# EAGLE design lcd (EAGLE 9.3.2)
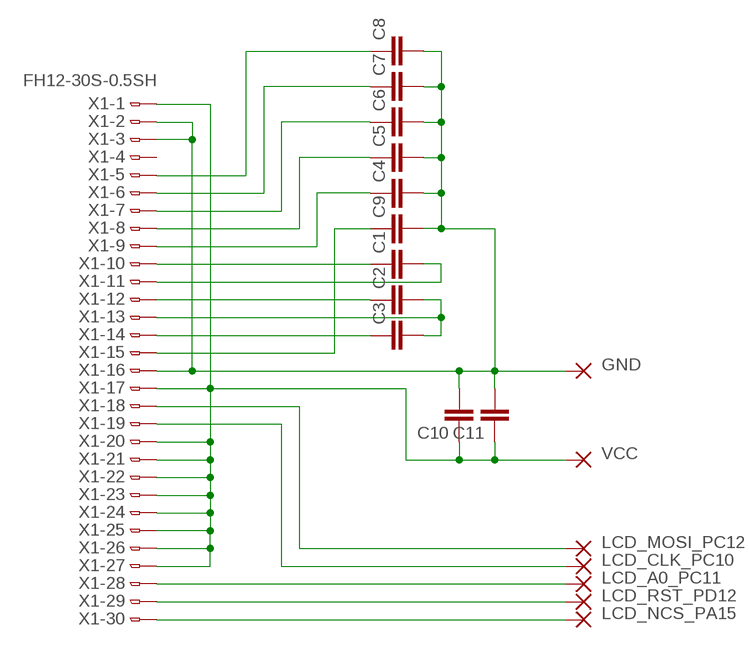
[diagram p0: schematic, sheet 1]

## Parts
C1  C-EUC0805  [C0805]
C2  C-EUC0805  [C0805]
C3  C-EUC0805  [C0805]
C4  C-EUC0805  [C0805]
C5  C-EUC0805  [C0805]
C6  C-EUC0805  [C0805]
C7  C-EUC0805  [C0805]
C8  C-EUC0805  [C0805]
C9  C-EUC0805  [C0805]
C10  C-EUC0805  [C0805]
C11  C-EUC0805  [C0805]
PAD1  WIREPADSMD5-2,5  [5-2,5]
PAD2  WIREPADSMD5-2,5  [5-2,5]
PAD3  WIREPADSMD5-2,5  [5-2,5]
PAD4  WIREPADSMD5-2,5  [5-2,5]
PAD5  WIREPADSMD5-2,5  [5-2,5]
PAD6  WIREPADSMD5-2,5  [5-2,5]
PAD7  WIREPADSMD5-2,5  [5-2,5]
X1  FH12-30S-0.5SH  [FH12-30S-0.5SH]

## Nets
GND: C4.2 C5.2 C6.2 C7.2 C8.2 C9.2 C10.2 C11.2 PAD6.1(P) X1.2 X1.3 X1.16
LCD_A0_PC11: PAD3.1(P) X1.28
LCD_CLK_PC10: PAD2.1(P) X1.19
LCD_MOSI_PC12: PAD1.1(P) X1.18
LCD_NCS_PA15: PAD5.1(P) X1.30
LCD_RST_PD12: PAD4.1(P) X1.29
N$2: C1.1 X1.10
N$3: C9.1 X1.15
N$9: C4.1 X1.9
N$11: C5.1 X1.8
N$15: C6.1 X1.7
N$16: C7.1 X1.6
N$17: C8.1 X1.5
N$18: C3.1 X1.14
N$19: C2.2 C3.2 X1.13
N$20: C2.1 X1.12
N$21: C1.2 X1.11
VCC: C10.1 C11.1 PAD7.1(P) X1.1 X1.17 X1.20 X1.21 X1.22 X1.23 X1.24 X1.25 X1.26 X1.27
Unconnected: X1.4

## Library data of the parts
C1-C11 = rcl:C-EU: CAPACITOR, European symbol; SPICEPREFIX: C
PAD1-PAD7 = wirepad:WIREPAD: Wire PAD connect wire on PCB
X1 = con-hirose:FH12-30S-0.5S: 0.5mm Pitch Connectors For FPC/FFC Source: Data sheet <http://www.hirose.co.jp/cataloge_hp/e58605370.pdf>; MPN: FH12-30S-0.5SH(55); OC_FARNELL: 1324555; OC_NEWARK: 34M6176

## Board
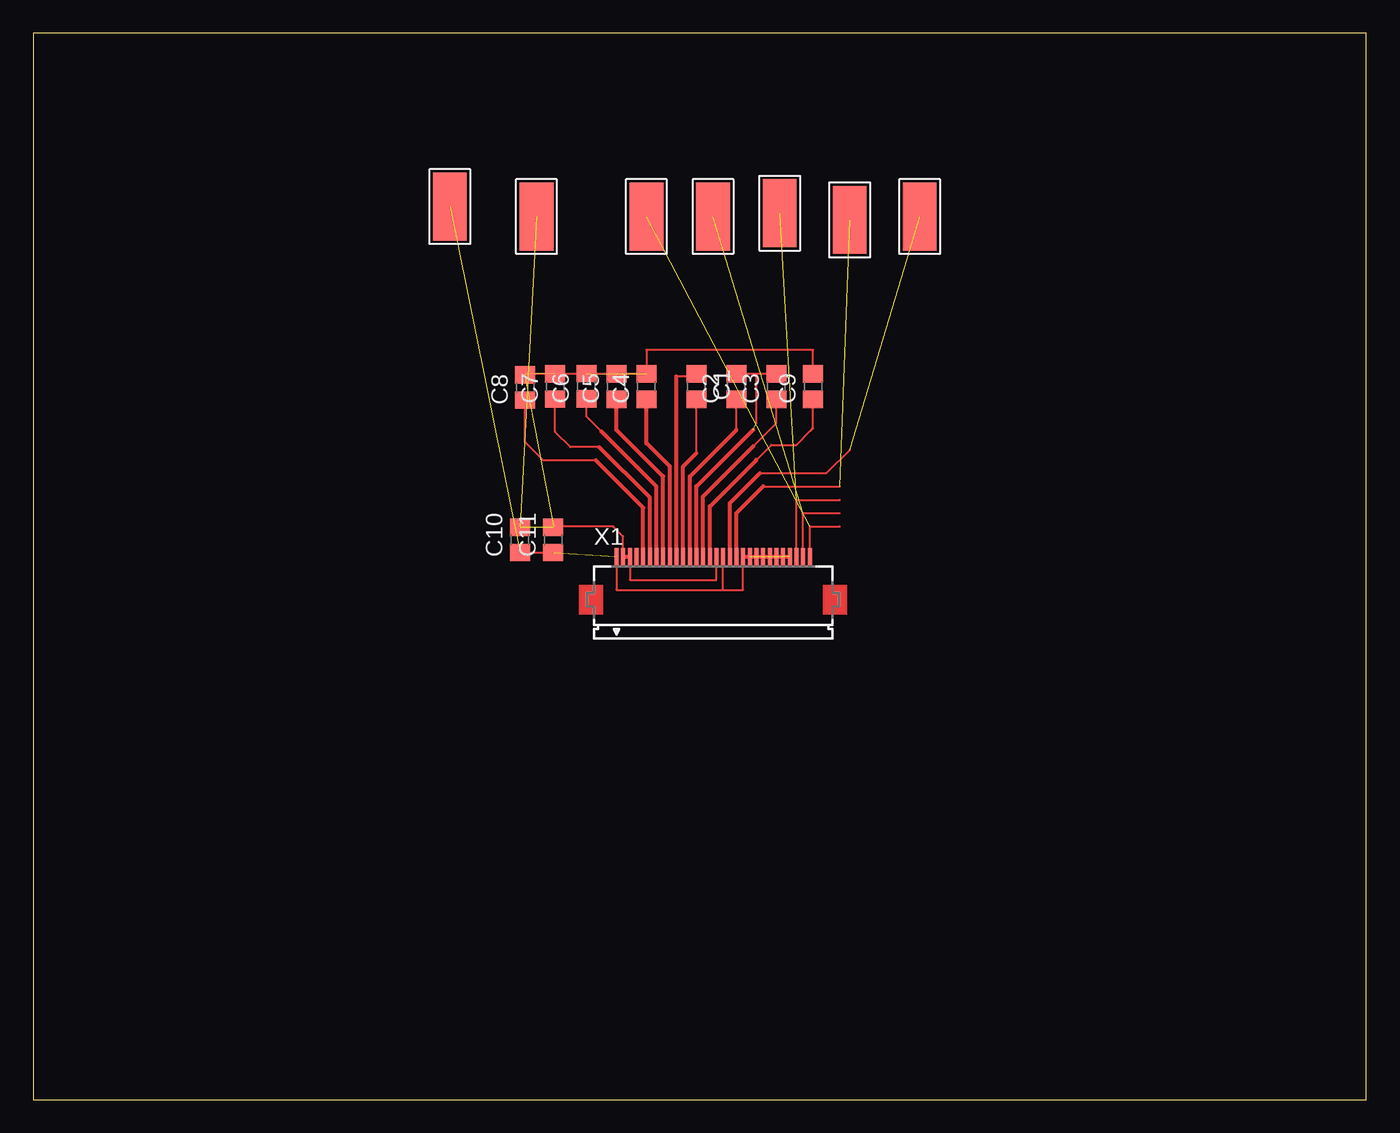
[diagram p1: board, top side]

Size 100 x 80 mm. Coordinates in mm from the lower left corner, seen from the top.
Outline: 0,0 100,0 100,80 0,80 0,0
Copper layers (1*16): Top 0.035mm / dielectric 1.5mm / Bottom 0.035mm
Design rules "default": minimum track width 6mil, minimum drill 0.35mm, track to track 6mil, track to pad 6mil, pad to pad 6mil, via to via 6mil, smd to smd 6mil, copper to edge 40mil, drill to drill 6mil, minimum pad ring 10mil, minimum via ring 8mil, stop-mask expansion 4mil, vias tented up to drill 0mil, thermal gap 10mil

### Footprints (pad centres in the part's own frame; a part is rotated, then mirrored left to right if it is on the bottom)
C0805 = smd 1.3 x 1.5: 1 -0.95,0; 2 0.95,0
5-2,5 = smd 2.54 x 5.08: 1 0,0
FH12-30S-0.5SH = smd 0.3 x 1.3: 1 -7.25,3.25; 2 -6.75,3.25; 3 -6.25,3.25; 4 -5.75,3.25; 5 -5.25,3.25; 6 -4.75,3.25; 7 -4.25,3.25; 8 -3.75,3.25; 9 -3.25,3.25; 10 -2.75,3.25; 11 -2.25,3.25; 12 -1.75,3.25; 13 -1.25,3.25; 14 -0.75,3.25; 15 -0.25,3.25; 16 0.25,3.25; 17 0.75,3.25; 18 1.25,3.25; 19 1.75,3.25; 20 2.25,3.25; 21 2.75,3.25; 22 3.25,3.25; 23 3.75,3.25; 24 4.25,3.25; 25 4.75,3.25; 26 5.25,3.25; 27 5.75,3.25; 28 6.25,3.25; 29 6.75,3.25; 30 7.25,3.25

### Placement (x,y rotation side)
C1  49.75,53.5 270 top
C2  52.75,53.5 90 top
C3  55.75,53.5 90 top
C4  46,53.5 90 top
C5  43.75,53.5 90 top
C6  41.49,53.52 90 top
C7  39.16,53.51 90 top
C8  36.91,53.43 90 top
C9  58.5,53.5 90 top
C10  36.5,42 90 top
C11  39,42 90 top
PAD1  66.5,66.25 0 top
PAD2  61.25,66 0 top
PAD3  56,66.5 0 top
PAD4  51,66.25 0 top
PAD5  46,66.25 0 top
PAD6  37.75,66.25 0 top
PAD7  31.25,67 0 top
X1  51,37.5 0 top

### Tracks (layer width: path | path; a pad name or v marks a point on that pad's centre or on a via)
GND  (6 unrouted)
  Top 0.152: X1.3 44.75,39 51.25,39 X1.16 | C8.2 36.91,54.45 C4.2 46,56.25 58.5,56.25 C9.2 | X1.2 44.25,42.25 43.5,43 39.05,43 C11.2
  Top 0.3: X1.2 X1.3
LCD_A0_PC11  (1 unrouted)
  Top 0.152: X1.28 57.25,45 60.5,45
LCD_CLK_PC10  (1 unrouted)
  Top 0.152: 54.75,46 60.5,46
  Top 0.3: X1.19 52.75,44 54.75,46
LCD_MOSI_PC12  (1 unrouted)
  Top 0.152: 61.25,48.75 59.5,47 54.5,47
  Top 0.3: X1.18 52.25,44.75 54.5,47
LCD_NCS_PA15  (1 unrouted)
  Top 0.152: X1.30 58.25,43 60.5,43
LCD_RST_PD12  (1 unrouted)
  Top 0.152: 60.5,44 57.75,44 X1.29
N$2
  Top 0.152: 48.25,54.25 49.75,54.25 C1.1
  Top 0.3: X1.10 48.25,54.25
N$3
  Top 0.152: 54.25,48 55.38,49.12 57.25,49.12 58.31,50.19 58.38,50.25 58.5,50.38 C9.1
  Top 0.3: X1.15 50.75,44.5 54.25,48
N$9
  Top 0.152: 45.98,52.52 C4.1 46,52.75
  Top 0.3: X1.9 47.75,47.5 46,49.25 C4.1
N$11
  Top 0.3: C5.1 43.75,50.25 47.25,46.75 X1.8
N$15
  Top 0.152: C6.1 41.49,51.25 42.62,50.12
  Top 0.3: 42.62,50.12 46.75,45.99 X1.7
N$16
  Top 0.152: 42.45,48.95 40.3,48.95 39.16,50.09 C7.1
  Top 0.3: X1.6 46.25,45.16 42.45,48.95
N$17
  Top 0.152: 36.84,52.41 C8.1 36.91,49.34 38.3,47.95 42.2,47.95
  Top 0.3: X1.5 45.75,44.41 42.2,47.95
N$18
  Top 0.152: C3.1 55.75,50.75 54,49
  Top 0.3: X1.14 50.25,45.25 54,49
N$19  (1 unrouted)
  Top 0.152: C3.2 54.25,54.45 | 54.25,54.45 C2.2 | 54.25,50.75 54.25,54.45
  Top 0.3: X1.13 49.75,46 54,50.25
N$20
  Top 0.152: 52.75,50.25 C2.1
  Top 0.3: X1.12 49.25,46.75 52.75,50.25
N$21
  Top 0.152: 49.75,48.5 C1.2
  Top 0.3: X1.11 48.75,47.5 49.75,48.5
VCC  (8 unrouted)
  Top 0.152: X1.1 43.75,38.25 51.75,38.25 | 51.75,38.25 X1.17 | 51.75,38.25 53.25,38.25 X1.20 | C10.1 C11.1
  Top 0.3: X1.20 X1.27